# Altium schematic sheet Mainboard_MotorDriverInterface.SchDoc
size A4
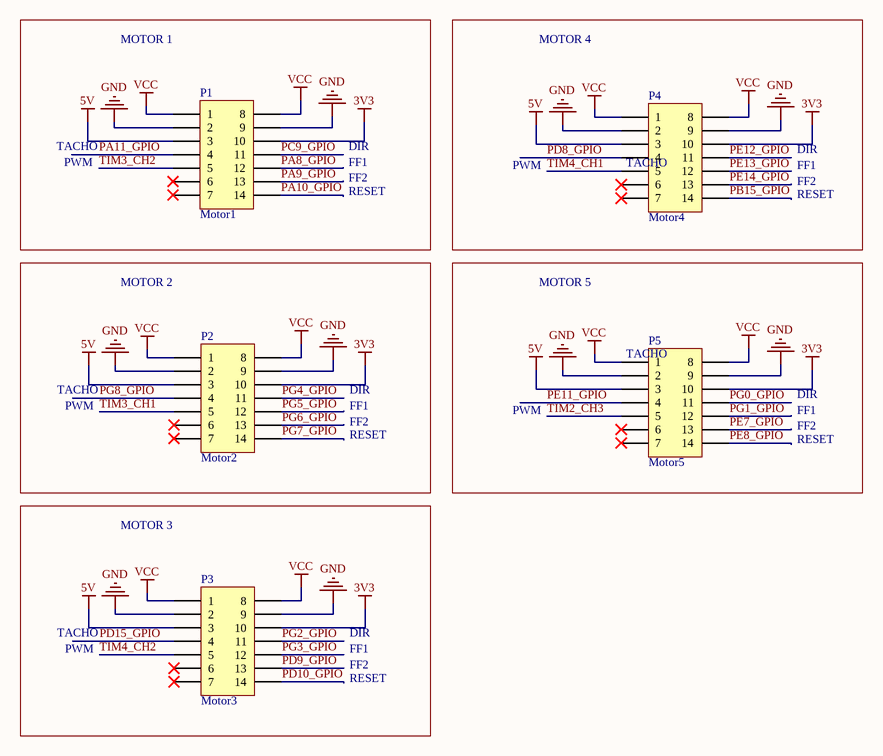
[diagram p0: Mainboard_MotorDriverInterface.SchDoc]

## Parts
P1  Motor1  [HDR2X7_CEN]
P2  Motor2  [HDR2X7_CEN]
P3  Motor3  [HDR2X7_CEN]
P4  Motor4  [HDR2X7_CEN]
P5  Motor5  [HDR2X7_CEN]

## Nets
3V3: P1.10 P2.10 P3.10 P4.10 P5.10
5V: P1.3 P2.3 P3.3 P4.3 P5.3
GND: P1.2 P1.9 P2.2 P2.9 P3.2 P3.9 P4.2 P4.9 P5.2 P5.9
VCC: P1.1 P1.8 P2.1 P2.8 P3.1 P3.8 P4.1 P4.8 P5.1 P5.8
PA8_GPIO: P1.12
PA9_GPIO: P1.13
PA10_GPIO: P1.14
PA11_GPIO: P1.4
PB15_GPIO: P4.14
PC9_GPIO: P1.11
PD8_GPIO: P4.4
PD9_GPIO: P3.13
PD10_GPIO: P3.14
PD15_GPIO: P3.4
PE7_GPIO: P5.13
PE8_GPIO: P5.14
PE11_GPIO: P5.4
PE12_GPIO: P4.11
PE13_GPIO: P4.12
PE14_GPIO: P4.13
PG0_GPIO: P5.11
PG1_GPIO: P5.12
PG2_GPIO: P3.11
PG3_GPIO: P3.12
PG4_GPIO: P2.11
PG5_GPIO: P2.12
PG6_GPIO: P2.13
PG7_GPIO: P2.14
PG8_GPIO: P2.4
TIM2_CH3: P5.5
TIM3_CH1: P2.5
TIM3_CH2: P1.5
TIM4_CH1: P4.5
TIM4_CH2: P3.5

Not connected (* = marked no-connect by the designer): P1 6* 7*; P2 6* 7*; P3 6* 7*; P4 6* 7*; P5 6* 7*

## Notes on the sheet
- MOTOR 1
- MOTOR 4
- TACHO
- DIR
- PWM
- FF1
- FF2
- RESET
- (near P4) TACHO
- MOTOR 2
- MOTOR 5
- (near P5) TACHO
- MOTOR 3

## Library data of the parts
P1-P5 = Header 7X2A: Header, 7-Pin, Dual row; LatestRevisionDate: 17-Jul-2002; LatestRevisionNote: Re-released for DXP Platform.; Publisher: Altium Limited